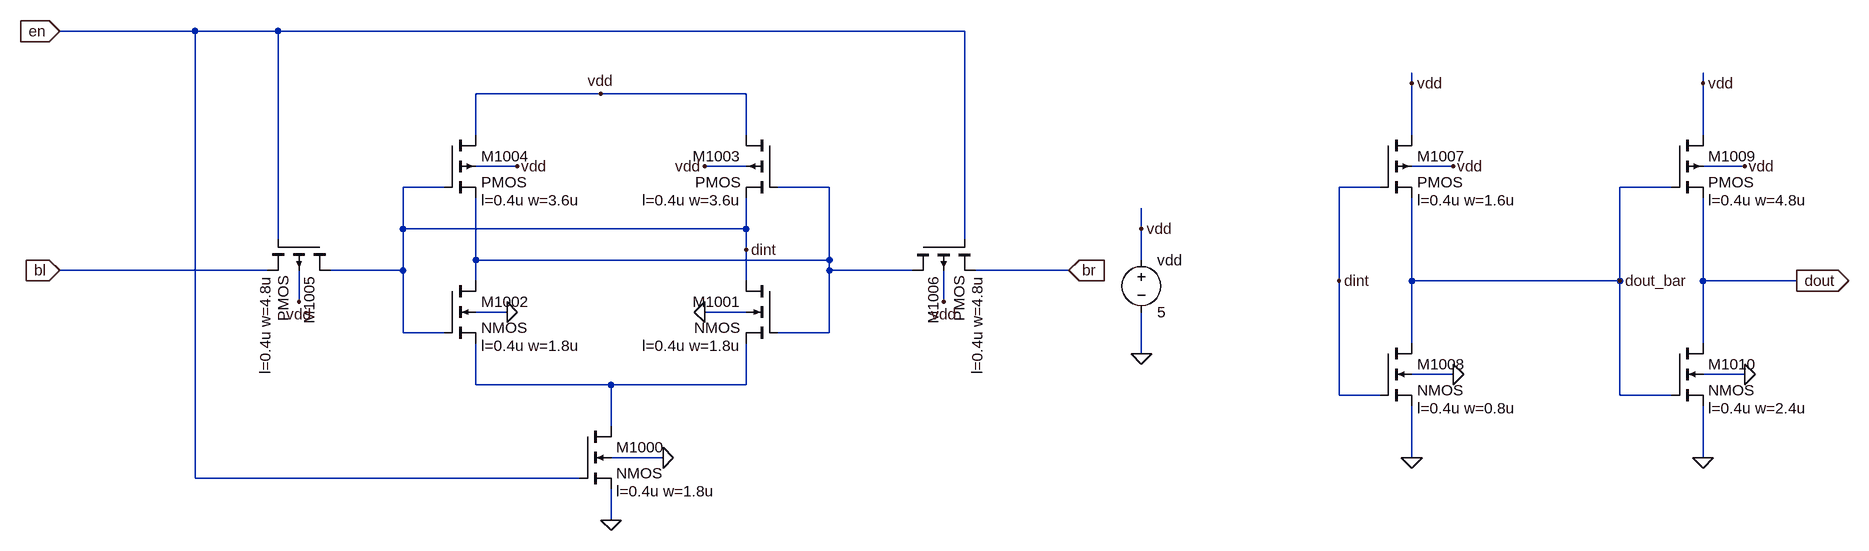
[diagram p0: schematic sense_amp.asc]
sense_amp.asc, the LTspice schematic file:
Version 4
SHEET 1 2104 1684
WIRE -2128 864 -2336 864
WIRE -2000 864 -2128 864
WIRE -944 864 -2000 864
WIRE -256 944 -256 928
WIRE 192 944 192 928
WIRE -1504 960 -1696 960
WIRE -1280 960 -1504 960
WIRE -1696 1024 -1696 960
WIRE -1280 1024 -1280 960
WIRE -256 1024 -256 944
WIRE 192 1024 192 944
WIRE -1632 1072 -1696 1072
WIRE -1280 1072 -1344 1072
WIRE -192 1072 -256 1072
WIRE 256 1072 192 1072
WIRE -1744 1104 -1808 1104
WIRE -1152 1104 -1232 1104
WIRE -304 1104 -368 1104
WIRE 144 1104 64 1104
WIRE -1808 1168 -1808 1104
WIRE -1280 1168 -1280 1120
WIRE -1280 1168 -1808 1168
WIRE -672 1168 -672 1136
WIRE -2000 1184 -2000 864
WIRE -944 1184 -944 864
WIRE -1280 1200 -1280 1168
WIRE -1696 1216 -1696 1120
WIRE -1152 1216 -1152 1104
WIRE -1152 1216 -1696 1216
WIRE -672 1216 -672 1168
WIRE -2016 1232 -2336 1232
WIRE -1808 1232 -1808 1168
WIRE -1808 1232 -1920 1232
WIRE -1152 1232 -1152 1216
WIRE -1024 1232 -1152 1232
WIRE -784 1232 -928 1232
WIRE -1696 1248 -1696 1216
WIRE -1280 1248 -1280 1200
WIRE -368 1248 -368 1104
WIRE -256 1248 -256 1120
WIRE 64 1248 64 1104
WIRE 64 1248 -256 1248
WIRE 192 1248 192 1120
WIRE 336 1248 192 1248
WIRE -1968 1280 -1968 1232
WIRE -976 1280 -976 1232
WIRE -1648 1296 -1696 1296
WIRE -1280 1296 -1344 1296
WIRE -1808 1328 -1808 1232
WIRE -1744 1328 -1808 1328
WIRE -1152 1328 -1152 1232
WIRE -1152 1328 -1232 1328
WIRE -256 1344 -256 1248
WIRE 192 1344 192 1248
WIRE -672 1360 -672 1296
WIRE -192 1392 -256 1392
WIRE 256 1392 192 1392
WIRE -1696 1408 -1696 1344
WIRE -1488 1408 -1696 1408
WIRE -1280 1408 -1280 1344
WIRE -1280 1408 -1488 1408
WIRE -368 1424 -368 1248
WIRE -304 1424 -368 1424
WIRE 64 1424 64 1248
WIRE 144 1424 64 1424
WIRE -1488 1472 -1488 1408
WIRE -1408 1520 -1488 1520
WIRE -256 1520 -256 1440
WIRE 192 1520 192 1440
WIRE -2128 1552 -2128 864
WIRE -1536 1552 -2128 1552
WIRE -1488 1616 -1488 1568
FLAG -256 1520 0
FLAG -672 1360 0
FLAG -672 1168 vdd
FLAG 192 944 vdd
FLAG -256 944 vdd
FLAG -368 1248 dint
FLAG 64 1248 dout_bar
FLAG 192 1520 0
FLAG 336 1248 dout
IOPIN 336 1248 Out
FLAG -1488 1616 0
FLAG -1280 1200 dint
FLAG -1504 960 vdd
FLAG -192 1392 0
FLAG 256 1392 0
FLAG -1344 1296 0
FLAG -1648 1296 0
FLAG -1408 1520 0
FLAG -1968 1280 vdd
FLAG -976 1280 vdd
FLAG -1632 1072 vdd
FLAG -1344 1072 vdd
FLAG 256 1072 vdd
FLAG -192 1072 vdd
FLAG -2336 864 en
IOPIN -2336 864 In
FLAG -2336 1232 bl
IOPIN -2336 1232 In
FLAG -784 1232 br
IOPIN -784 1232 In
SYMBOL nmos4 -1536 1472 R0
WINDOW 123 56 100 Left 2
SYMATTR InstName M1000
SYMATTR Value2 l=0.4u w=1.8u
SYMBOL nmos4 -1232 1248 M0
WINDOW 123 56 100 Left 2
SYMATTR InstName M1001
SYMATTR Value2 l=0.4u w=1.8u
SYMBOL nmos4 -1744 1248 R0
WINDOW 123 56 100 Left 2
SYMATTR InstName M1002
SYMATTR Value2 l=0.4u w=1.8u
SYMBOL nmos4 -304 1344 R0
WINDOW 123 56 100 Left 2
SYMATTR InstName M1008
SYMATTR Value2 l=0.4u w=0.8u
SYMBOL nmos4 144 1344 R0
WINDOW 123 56 100 Left 2
SYMATTR InstName M1010
SYMATTR Value2 l=0.4u w=2.4u
SYMBOL pmos4 -1232 1024 M0
WINDOW 123 56 100 Left 2
SYMATTR InstName M1003
SYMATTR Value2 l=0.4u w=3.6u
SYMBOL pmos4 -1744 1024 R0
WINDOW 123 56 100 Left 2
SYMATTR InstName M1004
SYMATTR Value2 l=0.4u w=3.6u
SYMBOL pmos4 -1920 1184 R90
WINDOW 123 56 100 Left 2
SYMATTR InstName M1005
SYMATTR Value2 l=0.4u w=4.8u
SYMBOL pmos4 -1024 1184 M90
WINDOW 123 56 100 Left 2
SYMATTR InstName M1006
SYMATTR Value2 l=0.4u w=4.8u
SYMBOL pmos4 144 1024 R0
WINDOW 123 56 100 Left 2
SYMATTR InstName M1009
SYMATTR Value2 l=0.4u w=4.8u
SYMBOL pmos4 -304 1024 R0
WINDOW 123 56 100 Left 2
SYMATTR InstName M1007
SYMATTR Value2 l=0.4u w=1.6u
SYMBOL voltage -672 1200 R0
SYMATTR InstName vdd
SYMATTR Value 5

The netlist it stands for:
* sense_amp.asc
M1000 N002 en 0 0 NMOS l=0.4u w=1.8u
M1001 dint N001 N002 0 NMOS l=0.4u w=1.8u
M1002 N001 dint N002 0 NMOS l=0.4u w=1.8u
M1008 dout_bar dint 0 0 NMOS l=0.4u w=0.8u
M1010 dout dout_bar 0 0 NMOS l=0.4u w=2.4u
M1003 vdd N001 dint vdd PMOS l=0.4u w=3.6u
M1004 vdd dint N001 vdd PMOS l=0.4u w=3.6u
M1005 dint en bl vdd PMOS l=0.4u w=4.8u
M1006 N001 en br vdd PMOS l=0.4u w=4.8u
M1009 vdd dout_bar dout vdd PMOS l=0.4u w=4.8u
M1007 vdd dint dout_bar vdd PMOS l=0.4u w=1.6u
vdd vdd 0 5
.model NMOS NMOS
.model PMOS PMOS
.lib standard.mos
.backanno
.end